# Altium schematic sheet PWM Drivers.SchDoc
size A3
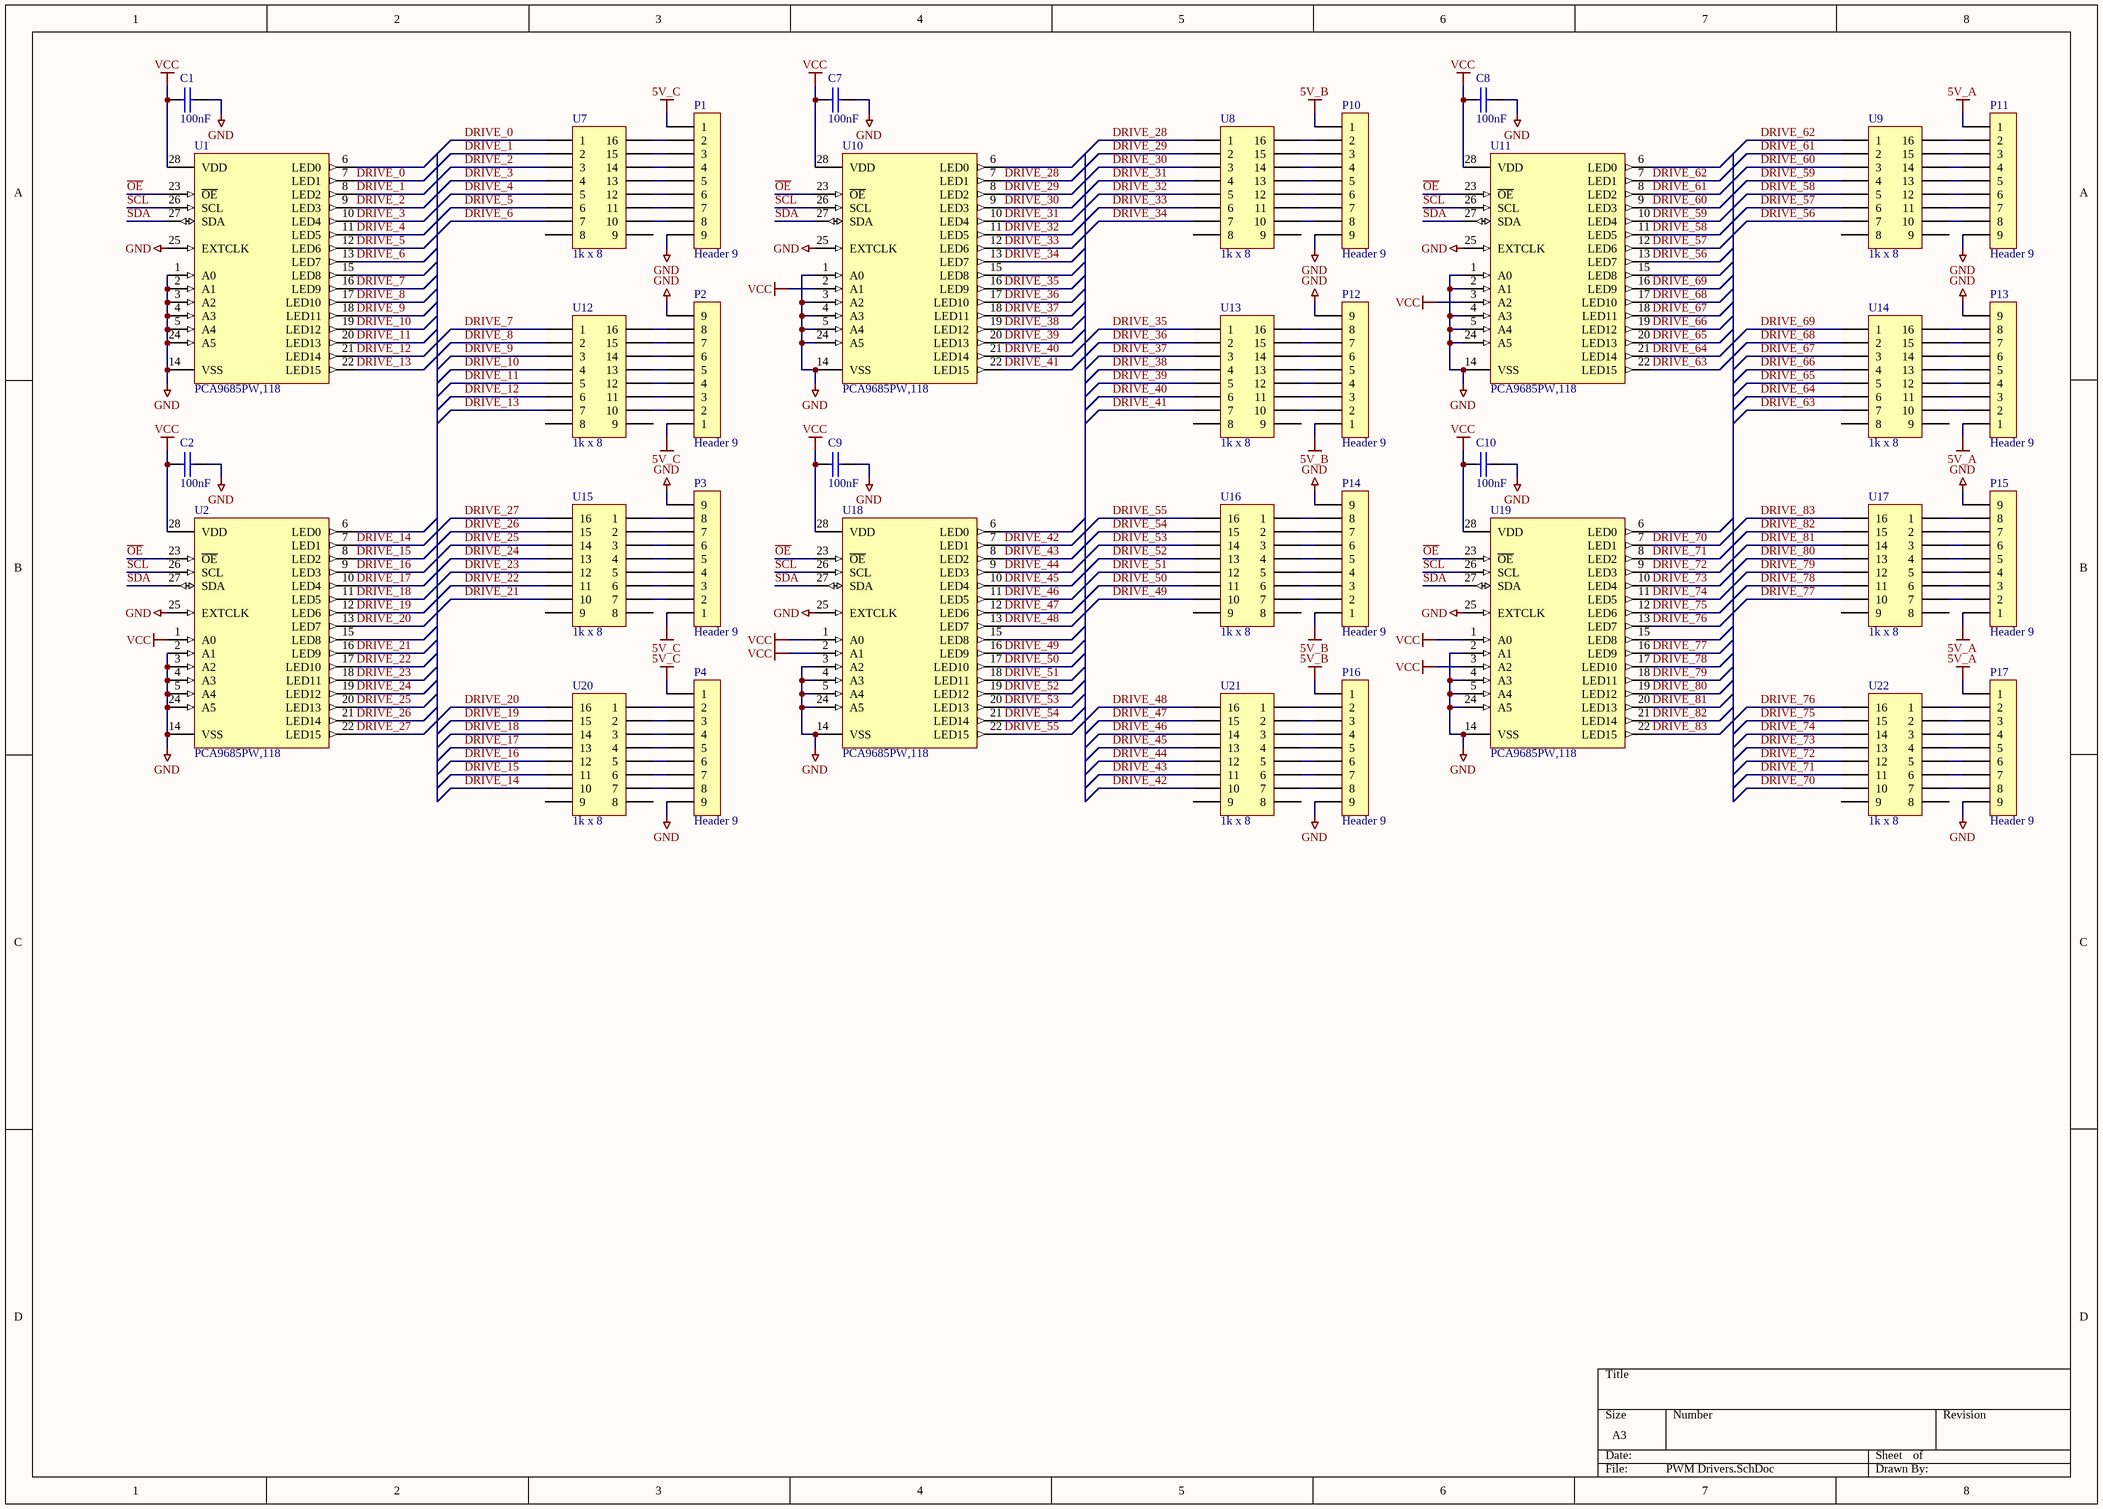
[diagram p0: PWM Drivers.SchDoc]

## Parts
C1  100nF  [CAPACITOR 0805]
C2  100nF  [CAPACITOR 0805]
C7  100nF  [CAPACITOR 0805]
C8  100nF  [CAPACITOR 0805]
C9  100nF  [CAPACITOR 0805]
C10  100nF  [CAPACITOR 0805]
P1  Header 9  [SOCKET 1x9]
P2  Header 9  [SOCKET 1x9]
P3  Header 9  [SOCKET 1x9]
P4  Header 9  [SOCKET 1x9]
P10  Header 9  [SOCKET 1x9]
P11  Header 9  [SOCKET 1x9]
P12  Header 9  [SOCKET 1x9]
P13  Header 9  [SOCKET 1x9]
P14  Header 9  [SOCKET 1x9]
P15  Header 9  [SOCKET 1x9]
P16  Header 9  [SOCKET 1x9]
P17  Header 9  [SOCKET 1x9]
U1  PCA9685PW,118  [SSOP28]
U2  PCA9685PW,118  [SSOP28]
U7  1k x 8  [DIP 16]
U8  1k x 8  [DIP 16]
U9  1k x 8  [DIP 16]
U10  PCA9685PW,118  [SSOP28]
U11  PCA9685PW,118  [SSOP28]
U12  1k x 8  [DIP 16]
U13  1k x 8  [DIP 16]
U14  1k x 8  [DIP 16]
U15  1k x 8  [DIP 16]
U16  1k x 8  [DIP 16]
U17  1k x 8  [DIP 16]
U18  PCA9685PW,118  [SSOP28]
U19  PCA9685PW,118  [SSOP28]
U20  1k x 8  [DIP 16]
U21  1k x 8  [DIP 16]
U22  1k x 8  [DIP 16]

## Nets
5V_A: P11.1 P13.1 P15.1 P17.1
5V_B: P10.1 P12.1 P14.1 P16.1
5V_C: P1.1 P2.1 P3.1 P4.1
GND: C1.2 C2.2 C7.2 C8.2 C9.2 C10.2 P1.9 P2.9 P3.9 P4.9 P10.9 P11.9 P12.9 P13.9 P14.9 P15.9 P16.9 P17.9 U1.1(A0) U1.2(A1) U1.3(A2) U1.4(A3) U1.5(A4) U1.14(VSS) U1.24(A5) U1.25(EXTCLK) U2.2(A1) U2.3(A2) U2.4(A3) U2.5(A4) U2.14(VSS) U2.24(A5) U2.25(EXTCLK) U10.1(A0) U10.3(A2) U10.4(A3) U10.5(A4) U10.14(VSS) U10.24(A5) U10.25(EXTCLK) U11.1(A0) U11.2(A1) U11.4(A3) U11.5(A4) U11.14(VSS) U11.24(A5) U11.25(EXTCLK) U18.3(A2) U18.4(A3) U18.5(A4) U18.14(VSS) U18.24(A5) U18.25(EXTCLK) U19.2(A1) U19.4(A3) U19.5(A4) U19.14(VSS) U19.24(A5) U19.25(EXTCLK)
VCC: C1.1 C2.1 C7.1 C8.1 C9.1 C10.1 U1.28(VDD) U2.1(A0) U2.28(VDD) U10.2(A1) U10.28(VDD) U11.3(A2) U11.28(VDD) U18.1(A0) U18.2(A1) U18.28(VDD) U19.1(A0) U19.3(A2) U19.28(VDD)
DRIVE_0: U1.7(LED1) U7.1
DRIVE_1: U1.8(LED2) U7.2
DRIVE_2: U1.9(LED3) U7.3
DRIVE_3: U1.10(LED4) U7.4
DRIVE_4: U1.11(LED5) U7.5
DRIVE_5: U1.12(LED6) U7.6
DRIVE_6: U1.13(LED7) U7.7
DRIVE_7: U1.16(LED9) U12.1
DRIVE_8: U1.17(LED10) U12.2
DRIVE_9: U1.18(LED11) U12.3
DRIVE_10: U1.19(LED12) U12.4
DRIVE_11: U1.20(LED13) U12.5
DRIVE_12: U1.21(LED14) U12.6
DRIVE_13: U1.22(LED15) U12.7
DRIVE_14: U2.7(LED1) U20.10
DRIVE_15: U2.8(LED2) U20.11
DRIVE_16: U2.9(LED3) U20.12
DRIVE_17: U2.10(LED4) U20.13
DRIVE_18: U2.11(LED5) U20.14
DRIVE_19: U2.12(LED6) U20.15
DRIVE_20: U2.13(LED7) U20.16
DRIVE_21: U2.16(LED9) U15.10
DRIVE_22: U2.17(LED10) U15.11
DRIVE_23: U2.18(LED11) U15.12
DRIVE_24: U2.19(LED12) U15.13
DRIVE_25: U2.20(LED13) U15.14
DRIVE_26: U2.21(LED14) U15.15
DRIVE_27: U2.22(LED15) U15.16
DRIVE_28: U8.1 U10.7(LED1)
DRIVE_29: U8.2 U10.8(LED2)
DRIVE_30: U8.3 U10.9(LED3)
DRIVE_31: U8.4 U10.10(LED4)
DRIVE_32: U8.5 U10.11(LED5)
DRIVE_33: U8.6 U10.12(LED6)
DRIVE_34: U8.7 U10.13(LED7)
DRIVE_35: U10.16(LED9) U13.1
DRIVE_36: U10.17(LED10) U13.2
DRIVE_37: U10.18(LED11) U13.3
DRIVE_38: U10.19(LED12) U13.4
DRIVE_39: U10.20(LED13) U13.5
DRIVE_40: U10.21(LED14) U13.6
DRIVE_41: U10.22(LED15) U13.7
DRIVE_42: U18.7(LED1) U21.10
DRIVE_43: U18.8(LED2) U21.11
DRIVE_44: U18.9(LED3) U21.12
DRIVE_45: U18.10(LED4) U21.13
DRIVE_46: U18.11(LED5) U21.14
DRIVE_47: U18.12(LED6) U21.15
DRIVE_48: U18.13(LED7) U21.16
DRIVE_49: U16.10 U18.16(LED9)
DRIVE_50: U16.11 U18.17(LED10)
DRIVE_51: U16.12 U18.18(LED11)
DRIVE_52: U16.13 U18.19(LED12)
DRIVE_53: U16.14 U18.20(LED13)
DRIVE_54: U16.15 U18.21(LED14)
DRIVE_55: U16.16 U18.22(LED15)
DRIVE_56: U9.7 U11.13(LED7)
DRIVE_57: U9.6 U11.12(LED6)
DRIVE_58: U9.5 U11.11(LED5)
DRIVE_59: U9.4 U11.10(LED4)
DRIVE_60: U9.3 U11.9(LED3)
DRIVE_61: U9.2 U11.8(LED2)
DRIVE_62: U9.1 U11.7(LED1)
DRIVE_63: U11.22(LED15) U14.7
DRIVE_64: U11.21(LED14) U14.6
DRIVE_65: U11.20(LED13) U14.5
DRIVE_66: U11.19(LED12) U14.4
DRIVE_67: U11.18(LED11) U14.3
DRIVE_68: U11.17(LED10) U14.2
DRIVE_69: U11.16(LED9) U14.1
DRIVE_70: U19.7(LED1) U22.10
DRIVE_71: U19.8(LED2) U22.11
DRIVE_72: U19.9(LED3) U22.12
DRIVE_73: U19.10(LED4) U22.13
DRIVE_74: U19.11(LED5) U22.14
DRIVE_75: U19.12(LED6) U22.15
DRIVE_76: U19.13(LED7) U22.16
DRIVE_77: U17.10 U19.16(LED9)
DRIVE_78: U17.11 U19.17(LED10)
DRIVE_79: U17.12 U19.18(LED11)
DRIVE_80: U17.13 U19.19(LED12)
DRIVE_81: U17.14 U19.20(LED13)
DRIVE_82: U17.15 U19.21(LED14)
DRIVE_83: U17.16 U19.22(LED15)
~{OE}: U1.23(~{OE}) U2.23(~{OE}) U10.23(~{OE}) U11.23(~{OE}) U18.23(~{OE}) U19.23(~{OE})
SCL: U1.26(SCL) U2.26(SCL) U10.26(SCL) U11.26(SCL) U18.26(SCL) U19.26(SCL)
SDA: U1.27(SDA) U2.27(SDA) U10.27(SDA) U11.27(SDA) U18.27(SDA) U19.27(SDA)
NetP1_2: P1.2 U7.16
NetP1_3: P1.3 U7.15
NetP1_4: P1.4 U7.14
NetP1_5: P1.5 U7.13
NetP1_6: P1.6 U7.12
NetP1_7: P1.7 U7.11
NetP1_8: P1.8 U7.10
NetP2_2: P2.2 U12.10
NetP2_3: P2.3 U12.11
NetP2_4: P2.4 U12.12
NetP2_5: P2.5 U12.13
NetP2_6: P2.6 U12.14
NetP2_7: P2.7 U12.15
NetP2_8: P2.8 U12.16
NetP3_2: P3.2 U15.7
NetP3_3: P3.3 U15.6
NetP3_4: P3.4 U15.5
NetP3_5: P3.5 U15.4
NetP3_6: P3.6 U15.3
NetP3_7: P3.7 U15.2
NetP3_8: P3.8 U15.1
NetP4_2: P4.2 U20.1
NetP4_3: P4.3 U20.2
NetP4_4: P4.4 U20.3
NetP4_5: P4.5 U20.4
NetP4_6: P4.6 U20.5
NetP4_7: P4.7 U20.6
NetP4_8: P4.8 U20.7
NetP10_2: P10.2 U8.16
NetP10_3: P10.3 U8.15
NetP10_4: P10.4 U8.14
NetP10_5: P10.5 U8.13
NetP10_6: P10.6 U8.12
NetP10_7: P10.7 U8.11
NetP10_8: P10.8 U8.10
NetP11_2: P11.2 U9.16
NetP11_3: P11.3 U9.15
NetP11_4: P11.4 U9.14
NetP11_5: P11.5 U9.13
NetP11_6: P11.6 U9.12
NetP11_7: P11.7 U9.11
NetP11_8: P11.8 U9.10
NetP12_2: P12.2 U13.10
NetP12_3: P12.3 U13.11
NetP12_4: P12.4 U13.12
NetP12_5: P12.5 U13.13
NetP12_6: P12.6 U13.14
NetP12_7: P12.7 U13.15
NetP12_8: P12.8 U13.16
NetP13_2: P13.2 U14.10
NetP13_3: P13.3 U14.11
NetP13_4: P13.4 U14.12
NetP13_5: P13.5 U14.13
NetP13_6: P13.6 U14.14
NetP13_7: P13.7 U14.15
NetP13_8: P13.8 U14.16
NetP14_2: P14.2 U16.7
NetP14_3: P14.3 U16.6
NetP14_4: P14.4 U16.5
NetP14_5: P14.5 U16.4
NetP14_6: P14.6 U16.3
NetP14_7: P14.7 U16.2
NetP14_8: P14.8 U16.1
NetP15_2: P15.2 U17.7
NetP15_3: P15.3 U17.6
NetP15_4: P15.4 U17.5
NetP15_5: P15.5 U17.4
NetP15_6: P15.6 U17.3
NetP15_7: P15.7 U17.2
NetP15_8: P15.8 U17.1
NetP16_2: P16.2 U21.1
NetP16_3: P16.3 U21.2
NetP16_4: P16.4 U21.3
NetP16_5: P16.5 U21.4
NetP16_6: P16.6 U21.5
NetP16_7: P16.7 U21.6
NetP16_8: P16.8 U21.7
NetP17_2: P17.2 U22.1
NetP17_3: P17.3 U22.2
NetP17_4: P17.4 U22.3
NetP17_5: P17.5 U22.4
NetP17_6: P17.6 U22.5
NetP17_7: P17.7 U22.6
NetP17_8: P17.8 U22.7

Not connected (* = marked no-connect by the designer): U1 6(LED0) 15(LED8); U2 6(LED0) 15(LED8); U7 8 9; U8 8 9; U9 8 9; U10 6(LED0) 15(LED8); U11 6(LED0) 15(LED8); U12 8 9; U13 8 9; U14 8 9; U15 8 9; U16 8 9; U17 8 9; U18 6(LED0) 15(LED8); U19 6(LED0) 15(LED8); U20 8 9; U21 8 9; U22 8 9

## Library data of the parts
C1 C2 C7-C10 = CAP: CAPACITOR SMD 0603; Manufacturer: Murata; Manufacturer Part No.: GCM188R71C104KA37D; value: 100nF; Mouser Part no.: 81-GCM188R71C104KA7D; Web link: http://au.mouser.com/ProductDetail/Murata/GCM188R71C104KA37D/?qs=aEuGZpxfbxWKAxwYn%252beTMg%3d%3d
P1-P4 P10-P17 = Header 9: Header, 9-Pin; LatestRevisionDate: 17-Jul-2002; LatestRevisionNote: Re-released for DXP Platform.; Publisher: Altium Limited
U1 U2 U10 U11 U18 U19 = PCA9685PW,118: LED Driver IC 16 Output Linear PWM Dimming 25mA 28-TSSOP; MF: NXP USA; Package: TSSOP-28 NXP Semiconductors; MP: PCA9685PW,118; Value: *; SnapEDA_Link: https://www.snapeda.com/parts/PCA9685PW%2C118/NXP%20USA%20Inc./view-part/1041520/?ref=snap; Digi-Key_Purchase_URL: https://www.digikey.in/product-detail/en/nxp-usa-inc/PCA9685PW,118/568-11925-1-ND/5221902?utm_source=snapeda&utm_medium=aggregator&utm_campaign=symbol; Digi-Key_Part_Number: 568-11925-1-ND
U7-U9 U12-U17 U20-U22 = ResistorArray: DIP 16 Resistor Array 8 x 1k; Value: 1k x 8; LCSC Part Number: C1525823